# Altium project Mataric.PrjPcb
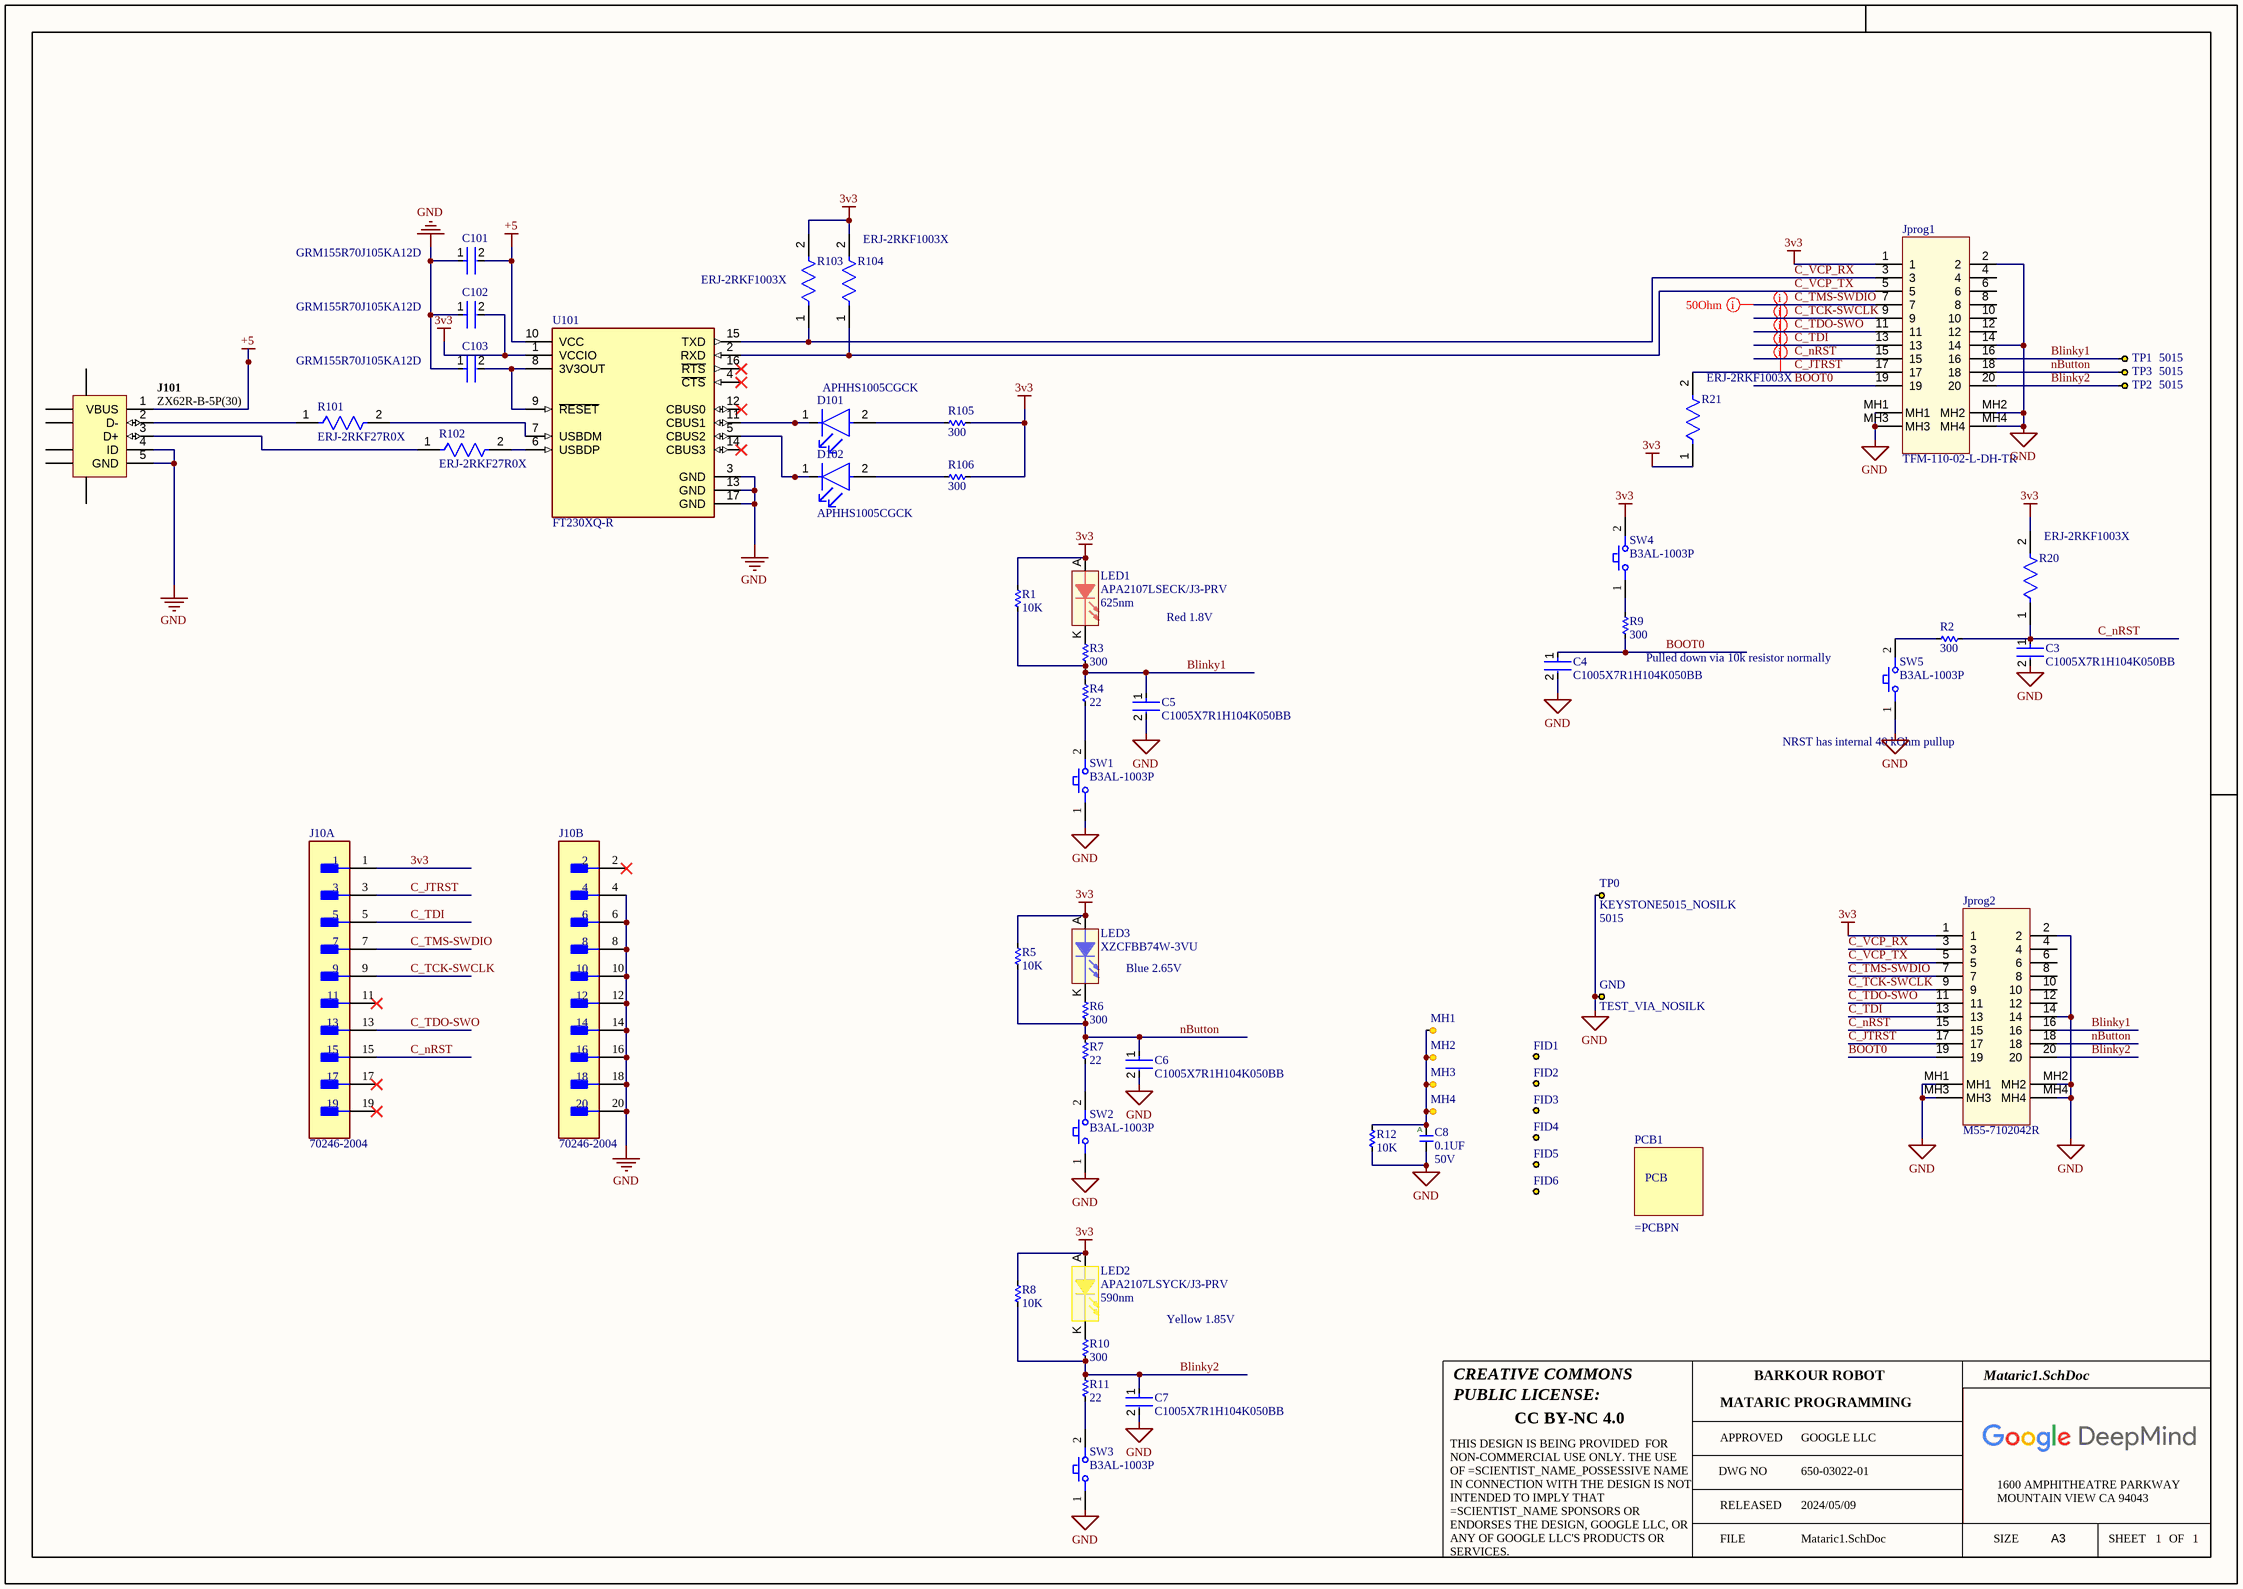
[diagram p0: Mataric1.SchDoc]
Scientist_Name_Possessive: MAJA MATARIC; Scientist_Name: MAJA MATARIC; Project_Name: MATARIC PROGRAMMING; GPN_PCBA: 650-03022-01
1 sheet, 60 parts. Net scope: global (net labels, ports and power ports of the same name join across sheets).
Board file: Mataric.PcbDoc

## Sheet Mataric1.SchDoc
size 420 x 297 mm; SheetNumber: 1; SheetTotal: 1

### Parts
C3  C1005X7R1H104K050BB  [FP-C1005-050-0_05-IPC_C]
C4  C1005X7R1H104K050BB  [FP-C1005-050-0_05-IPC_C]
C5  C1005X7R1H104K050BB  [FP-C1005-050-0_05-IPC_C]
C6  C1005X7R1H104K050BB  [FP-C1005-050-0_05-IPC_C]
C7  C1005X7R1H104K050BB  [FP-C1005-050-0_05-IPC_C]
C8  value 0.1UF  Voltage: 50V  [C0402]  (hidden comment: __Template_Cap_Auto)
C101  GRM155R70J105KA12D  [FP-GRM155-0_05-MFG]
C102  GRM155R70J105KA12D  [FP-GRM155-0_05-MFG]
C103  GRM155R70J105KA12D  [FP-GRM155-0_05-MFG]
D101  APHHS1005CGCK  [FP-APHHS1005CGCK-MFG]
D102  APHHS1005CGCK  [FP-APHHS1005CGCK-MFG]
FID1  FIDUCIAL  [FIDUCIAL_1MM]  (value not drawn)  (no BOM)
FID2  FIDUCIAL  [FIDUCIAL_1MM]  (value not drawn)  (no BOM)
FID3  FIDUCIAL  [FIDUCIAL_1MM]  (value not drawn)  (no BOM)
FID4  FIDUCIAL  [FIDUCIAL_1MM]  (value not drawn)  (no BOM)
FID5  FIDUCIAL  [FIDUCIAL_1MM]  (value not drawn)  (no BOM)
FID6  FIDUCIAL  [FIDUCIAL_1MM]  (value not drawn)  (no BOM)
GND  TEST_VIA_NOSILK  [TP_VIA_31pad_15drill_NS]  (no BOM)
J10  70246-2004  [FP-70246-2004-MFG]  (parts A,B of 2)
J101  ZX62R-B-5P(30)  [HIRO-ZX62R-B-5P_V]
Jprog1  MFG P/N: TFM-110-02-L-DH-TR  [SAMTEC_TFM-110-02-L-DH]
Jprog2  M55-7102042R  [CON_M55-7102042R]
LED1  value APA2107LSECK/J3-PRV  Color / Wavelength: 625nm  [LED_APA2106CGCK]  (hidden comment: __Template_LED_RED_AK)
LED2  value APA2107LSYCK/J3-PRV  Color / Wavelength: 590nm  [LED_APA2106CGCK]  (hidden comment: __Template_LED_YELLOW_AK)
LED3  value XZCFBB74W-3VU  [LED_APA2106CGCK]  (hidden comment: __Template_LED_BLUE_AK)
MH1  MH  [MH_1.6MM]  (value not drawn)  (no BOM)
MH2  MH  [MH_1.6MM]  (value not drawn)  (no BOM)
MH3  MH  [MH_1.6MM]  (value not drawn)  (no BOM)
MH4  MH  [MH_1.6MM]  (value not drawn)  (no BOM)
PCB1  PCB  (value not drawn)  (mechanical)
R1  value 10K  [R0805]
R2  value 300  [R0603]
R3  value 300  [R0603]
R4  value 22  [R0805]
R5  value 10K  [R0805]
R6  value 300  [R0603]
R7  value 22  [R0805]
R8  value 10K  [R0805]
R9  value 300  [R0603]
R10  value 300  [R0603]
R11  value 22  [R0805]
R12  value 10K  [R0805]
R20  ERJ-2RKF1003X  [FP-ERJ2RK-IPC_C]
R21  ERJ-2RKF1003X  [FP-ERJ2RK-IPC_C]
R101  ERJ-2RKF27R0X  [FP-ERJ2R-IPC_B]
R102  ERJ-2RKF27R0X  [FP-ERJ2R-IPC_B]
R103  ERJ-2RKF1003X  [FP-ERJ2RK-IPC_C]
R104  ERJ-2RKF1003X  [FP-ERJ2RK-IPC_C]
R105  value 300  [R0603]
R106  value 300  [R0603]
SW1  B3AL-1003P  [FP-B3AL-1003P-MFG]
SW2  B3AL-1003P  [FP-B3AL-1003P-MFG]
SW3  B3AL-1003P  [FP-B3AL-1003P-MFG]
SW4  B3AL-1003P  [FP-B3AL-1003P-MFG]
SW5  B3AL-1003P  [FP-B3AL-1003P-MFG]
TP0  KEYSTONE5015_NOSILK  MFG P/N: 5015  [KEYSTONE_5015_NS]
TP1  MFG P/N: 5015  [KEYSTONE_5015_NS]  (hidden comment: KEYSTONE5015_NOSILK)
TP2  MFG P/N: 5015  [KEYSTONE_5015_NS]  (hidden comment: KEYSTONE5015_NOSILK)
TP3  MFG P/N: 5015  [KEYSTONE_5015_NS]  (hidden comment: KEYSTONE5015_NOSILK)
U101  FT230XQ-R  [FP-QFN-16-MFG]

### Nets
3v3: C102.2 J10.1 Jprog1.1 Jprog2.1 LED1.A LED2.A LED3.A R1.2 R5.2 R8.2 R20.2 R21.1 R103.2 R104.2 R105.1 R106.1 SW4.2 U101.1(VCCIO)
+5: C101.2 J101.1(VBUS) U101.10(VCC)
GND: C3.2 C4.2 C5.2 C6.2 C7.2 C8.2 C101.1 C102.1 C103.1 GND.1 J10.4 J10.6 J10.8 J10.10 J10.12 J10.14 J10.16 J10.18 J10.20 J101.4(ID) J101.5(GND) Jprog1.2 Jprog1.14 Jprog1.MH1 Jprog1.MH2 Jprog1.MH3 Jprog1.MH4 Jprog2.2 Jprog2.14 Jprog2.MH1 Jprog2.MH2 Jprog2.MH3 Jprog2.MH4 R12.1 SW1.1 SW2.1 SW3.1 SW5.1 TP0.1 U101.3(GND) U101.13(GND) U101.17(GND)
Blinky1: C5.1 Jprog1.16 Jprog2.16 R1.1 R3.1 R4.2 TP1.1
Blinky2: C7.1 Jprog1.20 Jprog2.20 R8.1 R10.1 R11.2 TP2.1
BOOT0: C4.1 Jprog1.19 Jprog2.19 R9.1
C_JTRST: J10.3 Jprog1.17 Jprog2.17 R21.2
C_nRST: C3.1 J10.15 Jprog1.15 Jprog2.15 R2.1 R20.1
C_TCK-SWCLK: J10.9 Jprog1.9 Jprog2.9
C_TDI: J10.5 Jprog1.13 Jprog2.13
C_TDO-SWO: J10.13 Jprog1.11 Jprog2.11
C_TMS-SWDIO: J10.7 Jprog1.7 Jprog2.7
C_VCP_RX: Jprog1.3 Jprog2.3 R103.1 U101.15(TXD)
C_VCP_TX: Jprog1.5 Jprog2.5 R104.1 U101.2(RXD)
nButton: C6.1 Jprog1.18 Jprog2.18 R5.1 R6.1 R7.2 TP3.1
NetC8_1: C8.1 MH1.1 MH2.1 MH3.1 MH4.1 R12.2
NetC103_2: C103.2 U101.8(3V3OUT) U101.9(~{RESET})
NetD101_1: D101.1(C) U101.11(CBUS1)
NetD101_2: D101.2(A) R105.2
NetD102_1: D102.1(C) U101.5(CBUS2)
NetD102_2: D102.2(A) R106.2
NetJ101_2: J101.2(D-) R101.1
NetJ101_3: J101.3(D+) R102.1
NetLED1_K: LED1.K R3.2
NetLED2_K: LED2.K R10.2
NetLED3_K: LED3.K R6.2
NetR2_2: R2.2 SW5.2
NetR4_1: R4.1 SW1.2
NetR7_1: R7.1 SW2.2
NetR9_2: R9.2 SW4.1
NetR11_1: R11.1 SW3.2
NetR101_2: R101.2 U101.7(USBDM)
NetR102_2: R102.2 U101.6(USBDP)

Not connected (* = marked no-connect by the designer): J10 2* 11* 17* 19*; J101 6(SHLD) 7(SHLD) 8(SHLD) 9(SHLD) 10(SHLD) 11(SHLD); Jprog1 4 6 8 10 12; Jprog2 4 6 8 10 12; U101 4(~{CTS})* 12(CBUS0)* 14(CBUS3)* 16(~{RTS})*

### Layout directives
net class SE50Ohm: C_JTRST, C_nRST, C_TCK-SWCLK, C_TDI, C_TDO-SWO, C_TMS-SWDIO

### Notes on the sheet
- Red 1.8V
- Pulled down via 10k resistor normally
- NRST has internal 40 kOhm pullup
- Blue 2.65V
- Yellow 1.85V
- CREATIVE COMMONS
- PUBLIC LICENSE:
- BARKOUR ROBOT
- CC BY-NC 4.0
- APPROVED
- DWG NO
- GOOGLE LLC
- FILE
- RELEASED
- 2024/05/09
- SIZE
- 1600 AMPHITHEATRE PARKWAY
- MOUNTAIN VIEW CA 94043
- A3
- SHEET
- OF
- THIS DESIGN IS BEING PROVIDED  FOR NON-COMMERCIAL USE ONLY. THE USE OF =SCIENTIST_NAME_POSSESSIVE NAME IN CONNECTION WITH THE DESIGN IS NOT INTENDED TO IMPLY THAT =SCIENTIST_NAME SPONSORS OR ENDORSES THE DESIGN, GOOGLE LLC, OR ANY OF GOOGLE LLC'S PRODUCTS OR SERVICES.
- (in symbol 951) A

### Library data of the parts
C3-C7 = CMP-2000-05393-2: Multilayer Ceramic Capacitors 100nF ±10% 50V X7R SMD 0402; Voltage: 50V; Dielectric Material: Ceramic; Min Operating Temperature: -55°C; Depth: 0.5mm; Radiation Hardening: No; RoHS Compliant: Yes; Voltage Rating (DC): 50V; Lead Free: Lead Free; Resistor Type: Ceramic; Height: 0.5mm; Dielectric: X7R; Thickness: 0.022inch; Case/Package: 0402; Case Code (Metric): 1005; Termination: SMD/SMT; Capacitance: 100nF; Packaging: Tape and Reel; Max Operating Temperature: 125°C; Mount: Surface Mount; Package Quantity: 1; Width: 0.02inch; Weight: 2.3E-05oz; Voltage Rating: 50V; Tolerance: 10%; Construction: Flat; Case Code (Imperial): 0402; Length: 1mm; REACH SVHC: No SVHC; Series: C
C8 = 951: CAP, CER, X7R, 0.1uF, 50V, 10%, 0402, AUTO GRADE; ID: 951; MFG: TDK; MFG P/N: CGA2B3X7R1H104K050BB; XPN: 150-00281-00; PROXY: Use ID #1723; EES: 150-04463-00; Status: Released; Package: 0402; Dielectric: X7R; Tolerance: 10%; Height: 0.56mm T; ComponentLink1Description: Datasheet; COMMON: 150-00281-00; LOON: 150-00281-00; Gecko: 150-00281-00
C101-C103 = CMP-2008-04587-2: Chip Multilayer Ceramic Capacitors for General Purpose, 0402, 1.0uF, X7R, 15%, 10%, 6.3V; Capacitance: 1uF; Case Code (Metric): 1005; Min Operating Temperature: -55°C; Tolerance: 10%; Depth: 0.5mm; Max Operating Temperature: 125°C; Width: 0.5mm; Case Code (Imperial): 0402; Termination: SMD/SMT; Weight: 0.000212oz; Thickness: 0.022inch; Package Quantity: 10000; Packaging: Tape and Reel; Voltage Rating: 6.3V; Lead Free: Lead Free; Height: 0.5mm; Length: 1mm; Dielectric: X7R; Case/Package: 0402; Voltage Rating (DC): 6.3V; Material: Ceramic; Mount: Surface Mount
D101 D102 = CMP-44529-000044-1: LED GREEN CLEAR CHIP SMD; Viewing Angle: 120°; Dominant Wavelength: 570nm; Test Current: 20mA; Luminous Intensity: 50mcd; Forward Voltage: 2.1V; Number of LEDs: 1; Lens Color: Clear; Packaging: Tape and Reel; Max Operating Temperature: 85°C; Illumination Color: Green; Length: 1mm; Mount: Surface Mount; Lens Style: Clear; Color: Green; Number of Pins: 2; Wavelength: 570nm; Case/Package: 0402; Width: 0.5mm; Package Quantity: 2000; Case Code (Metric): 1005; Height: 0.6mm; Lead Free: Lead Free; Case Code (Imperial): 0402; Forward Current: 20mA; Min Operating Temperature: -40°C
FID1-FID6 = 93: FIDUCIAL 1MM COPPER CIRCLE 3MM MASK PULLBACK; ID: 93; MFG: _PCB Feature; Status: In Development
GND = 171: TEST VIA, NO SILKSCREEN, 15 MIL DRILL, 31 MIL PAD; ID: 171; MFG: _PCB Feature; Status: Released; Category: Testpoint vias
J10 = CMP-04776-000337-1: CONN HEADER VERT 20POS 2.54MM; Voltage Rating (DC): 250V; Number of Contacts: 20; Current Rating: 2.5A; Glow Wire Compliant: Non-compliant; Gender: Male; Termination: Solder; Min Operating Temperature: -55°C; Voltage Rating: 250V; Series: 70246; Orientation: Vertical; Radiation Hardening: No; Contact Material: Gold; Number of Circuits: 20; Packaging: Tray; Flammability Rating: UL94 V-0; Contact Plating: Gold; Max Voltage Rating (DC): 250V; Package Quantity: 720; ELV: Compliant; Max Operating Temperature: 120°C; Number of Positions: 20; Number of Rows: 2; Pitch: 2.54mm; Mount: Through Hole
J101 = CMP-0031-00001-1: Connector; USBMicro-B,Reverse type, SMT; 5 Position; Right Angle; DatasheetVersion: 08/2010; Operating Temperature: -30 to 85 degC; Mounting Technology: Surface Mount; PartNumber: ZX62R-B-5P(30); PackageReference: ZX62R-B-5P; ComponentLink2URL: http://www.hirose.co.jp/cataloge_hp/e24200011.pdf; ComponentLink1URL: http://www.hirose.com/â€Ž; ComponentLink2Description: Datasheet; PackageDescription: 5-Pin USB Micro-B R/A Connector; ComponentLink1Description: Manufacturer URL
Jprog1 = 1204: CONN, HDR, SHRD, RA, 2x10, 1.27MM P, 6.02MM h, GOLD, TH; ID: 1204; MFG: Samtec Inc; Connector Type: Header; Number of Positions: 20; Current Rating: 2.9A; Voltage, Rated: 275VAC; Sub Assy Qty 2: 0; EES: 210-04980-00; Status: Released; RoHS Compliant: Yes; Mounting Type: Surface Mount; Orientation: Right Angle; Pitch: 1.27mm; Number of Rows: 2; Row Spacing: 1.27mm; Gender: Header; Operating Temperature: -55°C ~ 125°C; Supplier 1: Digi-Key; HelpURL: https://www.digikey.com/en/products/detail/samtec-inc/TFM-110-02-L-DH-TR/6694026; ComponentLink1Description: Datasheet; ComponentLink1URL: http://suddendocs.samtec.com/prints/tfm-1xx-xx-x-dh-xx-mkt.pdf; Height: 6.02mm; Supplier Part Number 1: SAM14687TR-ND; Sub Assy Qty 3: 0; Sub Assy Qty 4: 0
Jprog2 = 1204: CONN HEADER SMD R/A 20POS 1.27MM; MFG: Harwin Inc.; Status: Released; MFG P/N: M55-7102042R; Supplier 1: Digi-Key; ComponentLink1URL: https://www.digikey.com/en/products/detail/harwin-inc/M55-7102042R/8537613?s=N4IgTCBcDaILIFYEFoDsBGADGTAWMASiALoC%2BQA; Supplier Part Number 1: 952-3893-1-ND; Value: M55-7102042R
LED1 = 280: LED, RED, 640NM, INDEPENDENT, CLEAR, RA, SMD-2; ID: 280; MFG: Kingbright; EES: 370-00593-00; Status: Released; MFG P/N: APA2107LSECK/J3-PRV; Package: 2-SMD, No Lead; Category: Diode; RoHS Compliant: Yes; Diode Type: LED; Mounting Type: SMD; Supplier 1: Digi-Key; HelpURL: https://www.digikey.com/product-detail/en/kingbright/APA2107LSECK-J3-PRV/754-2094-1-ND/7319022; ComponentLink1Description: Datasheet; ComponentLink1URL: http://www.kingbrightusa.com/images/catalog/SPEC/APA2107LSECK-J3-PRV.pdf; Height: 0.7mm; Supplier Part Number 1: 754-2094-1-ND
LED2 = 279: LED, YELLOW, 590NM, CLEAR, RA, SMD-2; ID: 279; MFG: Kingbright; Voltage – Forward (VF) (MAX) @ IF: 1.85V; EES: 370-00592-00; Status: Released; MFG P/N: APA2107LSYCK/J3-PRV; Package: 2-SMD, No Lead; Category: Diode; RoHS Compliant: Yes; Diode Type: LED; Mounting Type: SMD; Supplier 1: Digi-Key; HelpURL: https://www.digikey.com/product-detail/en/kingbright/APA2107LSYCK-J3-PRV/754-1922-1-ND/5177452; ComponentLink1Description: Datasheet; ComponentLink1URL: http://www.kingbrightusa.com/images/catalog/SPEC/APA2107LSYCK-J3-PRV.pdf; Height: 0.7mm; Supplier Part Number 1: 754-1922-1-ND
LED3 = 281: LED, BLUE, 465NM, INDEPENDENT, CLEAR, RA, SMD-2; ID: 281; MFG: SunLED; Color / Wavelength: 470nm; EES: 370-00594-00; Status: Released; MFG P/N: XZCFBB74W-3VU; Package: 2-SMD, No Lead; Category: Diode; RoHS Compliant: Yes; Diode Type: LED; Mounting Type: SMD; Supplier 1: Digi-Key; HelpURL: https://www.digikey.com/product-detail/en/sunled/XZCFBB74W-3VU/1497-XZCFBB74W-3VUCT-ND/10449786; ComponentLink1Description: Datasheet; ComponentLink1URL: https://www.sunledusa.com/products/spec/XZCFBB74W-3VU.pdf; Height: 0.7mm; Supplier Part Number 1: 1497-XZCFBB74W-3VUCT-ND
MH1-MH4 = 144: MOUNTING HOLE, M1.6, 4.0mm PAD; ID: 144; Status: Released
PCB1 = 110: ID: 110; Level: 1; FindNumber: 010; Org: ORG - REP; Type: PCB; GPN: =PCBPN; Status: In Development; MFG P/N: =PCBPN; PROXY: =PCBPN; Type: 651-PCB; ItemNumber: =PCBPN; ProductLine: Proxy
R1 R5 R8 R12 = 4154: RES, 10K, 1%, 1/8W, 0805; ID: 4154; MFG: YAGEO; MFG P/N: RC0805FR-0710KL; COMMON: 470-07506-00; PROXY: 470-16861-00; Gecko: 470-17702-00; XPN: XS-10018162; EES: 470-17984-00; Status: Released; Package: 0805; Power: 1/8W; Tolerance: 1%; Height: 0.60mm; Supplier 1: Digi-Key; LOON: 470-07506-00; Supplier Part Number 1: 311-10.0KCRCT-ND
R2 R3 R6 R9 R10 R105 R106 = 2806: Resistor, 300 Ohms, 0603, 0.1W, ±1%; ID: 2806; MFG: YAGEO; MFG P/N: RC0603FR-07300RL; Power: 1/10W; COMMON: 470-06251-00; XPN: XS-10017062; EES: 470-17796-00; Status: Released; Package: 0603; Tolerance: 1%; Height: 0.55mm; Supplier 1: Digi-Key; LOON: 470-06251-00; Gecko: 470-06251-00; Supplier Part Number 1: 311-300HRCT-ND
R4 R7 R11 = 1785: Resistor, 22.0 Ohms, 0805, 0.125W, ±1%; ID: 1785; MFG: YAGEO; MFG P/N: RC0805FR-0722RL; Power: 1/8W; COMMON: 470-05283-00; XPN: XS-10016192; EES: 470-17982-00; Status: Released; Package: 0805; Tolerance: 1%; Height: 0.60mm; Supplier 1: Digi-Key; LOON: 470-05283-00; Gecko: 470-05283-00; Supplier Part Number 1: 311-22.0CRCT-ND
R20 R21 R103 R104 = CMP-2002-00608-4: RES SMD 100K OHM 1% 1/10W 0402; Resistance: 100kR; Voltage Rating (DC): 50V; Power Rating: 100mW; Temperature Coefficient: 100ppm/°C; Case/Package: 0402; Length: 1mm; Package Quantity: 1; Radiation Hardening: No; Case Code (Metric): 1005; Contact Plating: Tin; Mount: Surface Mount; Depth: 0.5mm; Max Operating Temperature: 155°C; Lead Free: Lead Free; Width: 0.5mm; Composition: Thick Film; Case Code (Imperial): 0402; Tolerance: 1%; Termination: SMD/SMT; Number of Pins: 2; Height: 0.35mm; Voltage Rating: 50V; Military Standard: Not; REACH SVHC: No SVHC; Packaging: Tape and Reel; Min Operating Temperature: -55°C; Max Power Dissipation: 100mW; Features: Automotive AEC-Q200; Number of Terminations: 2
R101 R102 = CMP-2002-00830-2: RES SMD 27 OHM 1% 1/10W 0402; Voltage Rating: 50V; Temperature Coefficient: 100ppm/°C; Resistance: 27R; Power Rating: 100mW; Military Standard: Not; Construction: Rectangular; Tolerance: 1%; Features: Automotive AEC-Q200; Length: 1mm; Lead Free: Lead Free; Mount: Surface Mount; Number of Terminations: 2; Radiation Hardening: No; Number of Pins: 2; Width: 0.5mm; Contact Plating: Tin; Voltage Rating (DC): 50V; Resistance Tolerance: 1%; Series: ERJ; Packaging: Tape and Reel; Case/Package: 0402; Technology: THICK FILM; REACH SVHC: No SVHC; Depth: 0.5mm; Resistor Type: Thick Film; Package Quantity: 1; Termination: SMD/SMT; Case Code (Imperial): 0402; Height: 0.35mm; Weight: 2.8E-05oz; Max Operating Temperature: 155°C; Case Code (Metric): 1005; Min Operating Temperature: -55°C; RoHS Compliant: Yes; Max Power Dissipation: 100mW
SW1-SW5 = CMP-08834-000018-1: SWITCH TACTILE SPST-NO 0.05A 16V; Contact Resistance: 100mR; Illumination Type: Non-Illuminated; Electrical Life: 1000000Cycles; Switch Function: Off-Mom; Switch Travel: 1.3mm; Contact Current Rating: 50mA; Actuator Color: White; Operating Force: 3.5N; Throw Configuration: SPST; Package Quantity: 1; Orientation: Straight; Radiation Hardening: No; Packaging: Tape and Reel; Max Voltage Rating (DC): 16V; Mechanical Life: 1000000Cycles; Min Operating Temperature: -40°C; Depth: 6.6mm; Voltage Rating (DC): 16V; Contact Plating: Silver; Mount: Surface Mount; Series: B3AL; Termination: SMD/SMT; Max Current Rating: 50mA; RoHS Compliant: Yes; Max Operating Temperature: 90°C; Current Rating: 50mA; Length: 6.9mm; Weight: 0.18g
TP0-TP3 = 176: HW, TEST POINT, NO SILKSCREEN, PC MINIATURE, 0.25mm T, 1.52mm HEIGHT, SILVER PLATING, SMT; ID: 176; MFG: Keystone Electronics Corp.; COMMON: 250-00207-00; PROXY: 250-04113-00; KOI: 250-07313-00; XPN: XS-10008125; EES: 250-08552-00; EPIC: 250-08204-00; Status: In Development; Category: Test and Measurement; Supplier 1: Digi-Key; Height: 1.65mm; Mounting Type: SMD; HelpURL: https://www.digikey.com/product-detail/en/keystone-electronics/5015/36-5015CT-ND/278886; ComponentLink1Description: Datasheet; ComponentLink1URL: http://keyelco.com/userAssets/file/M65p55.pdf; LOON: 250-00207-00; Gecko: 250-00207-00; Supplier Part Number 1: 36-5015CT-ND
U101 = CMP-0248-00010-3: IC USB SERIAL BASIC UART 16QFN; Number of Channels: 1; Data Rate: 12Mbps; Operating Supply Current: 8mA; Max Supply Voltage: 5.5V; Operating Supply Voltage: 5V; Min Supply Voltage: 2.97V; Width: 4mm; Length: 4mm; Height: 0.75mm; Max Operating Temperature: 85°C; Interface: USB; Min Operating Temperature: -40°C; Package Quantity: 5000; Lead Free: Lead Free; Number of Pins: 16; Case/Package: QFN; Weight: 0.002014oz; Packaging: Tape and Reel; Mount: Surface Mount

## Assembly variants
PCBA: all parts fitted